# Altium schematic sheet ui_mcup.SchDoc: mcHF QRP Transceiver UI board
size A4; Author: K Atanassov; CompanyName: M0NKA; Revision: 0.6.3; SheetTotal: 5
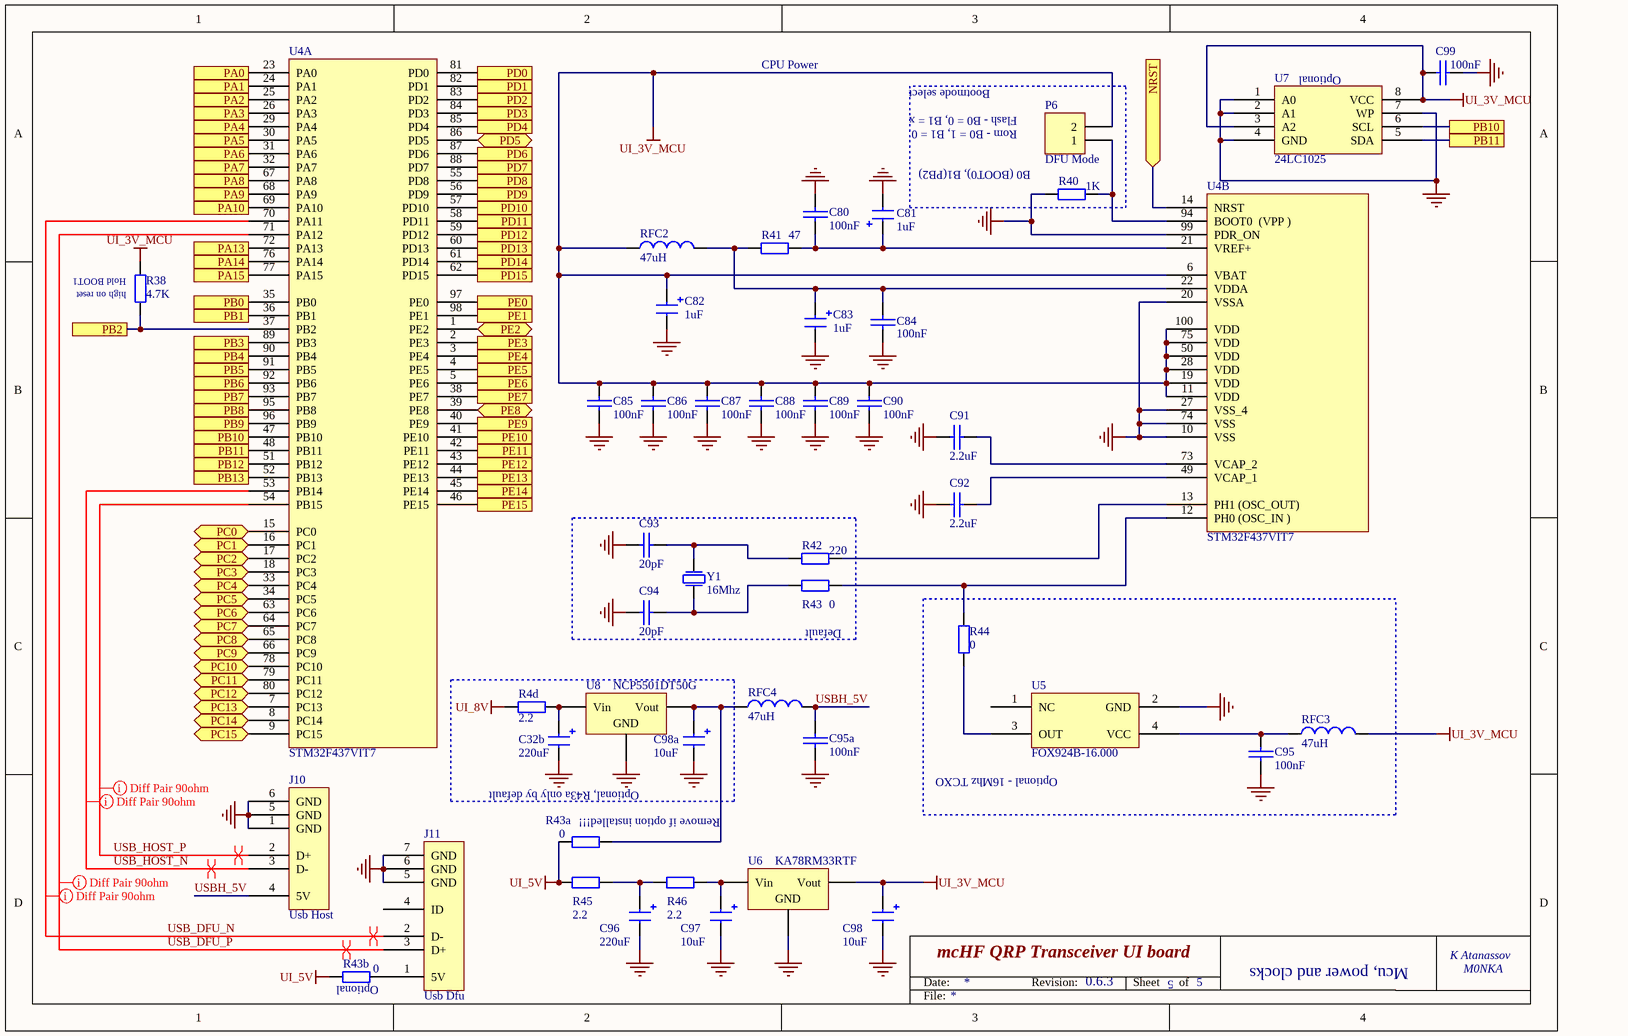
[diagram p0: ui_mcup.SchDoc]

## Parts
C32b  220uF  [CAP_ALUM]  (no BOM)
C80  100nF  [0805-Pro]
C81  1uF  [1206_ELEC_CAP_N]
C82  1uF  [1206_ELEC_CAP_N]
C83  1uF  [1206_ELEC_CAP_N]
C84  100nF  [0805-Pro]
C85  100nF  [0805-Pro]
C86  100nF  [0805-Pro]
C87  100nF  [0805-Pro]
C88  100nF  [0805-Pro]
C89  100nF  [0805-Pro]
C90  100nF  [0805-Pro]
C91  2.2uF  [0805-Pro]
C92  2.2uF  [0805-Pro]
C93  20pF  [0805-Pro]
C94  20pF  [0805-Pro]
C95  100nF  [0805-Pro]  (no BOM)
C95a  100nF  [0805-Pro]
C96  220uF  [CAP_ALUM]
C97  10uF  [1206_ELEC_CAP_N]
C98  10uF  [1206_ELEC_CAP_N]
C98a  10uF  [1206_ELEC_CAP_N]  (no BOM)
C99  100nF  [0805-Pro]
J10  Usb Host  [USB_OUT_A]
J11  Usb Dfu  [MINI_USB_B_SMD]
P6  DFU Mode  [SIP2]
R4d  2.2  [1206]  (no BOM)
R38  4.7K  [0805-Pro]
R40  1K  [0805-Pro]
R41  47  [0805-Pro]
R42  220  [0805-Pro]
R43  0  [0805-Pro]
R43a  0  [0805-Pro]
R43b  0  [0805-Pro]
R44  0  [0805-Pro]  (no BOM)
R45  2.2  [1206]
R46  2.2  [1206]
RFC2  47uH  [0805-Pro]
RFC3  47uH  [0805-Pro]  (no BOM)
RFC4  47uH  [0805-Pro]
U4  STM32F437VIT7  [SQFP14X14-100-Pro]  (parts A,B of 2)
U5  FOX924B-16.000  [2SMX-3SMXB]  (no BOM)
U6  KA78RM33RTF  [TO-252]
U7  24LC1025  [SO-8-Pro]
U8  NCP5501DT50G  [TO-252]  (no BOM)
Y1  16Mhz  [HC49/4H_SMX]

## Blocks framed on the sheet
Default: C93 C94 R42 R43 Y1
Optional - 16Mhz TCXO: C95 R44 RFC3 U5
Optional, R43a only by default: C32b C98a R4d U8

## Ports
NRST (in), PA0, PA1, PA2, PA3, PA4, PA5, PA6, PA7, PA8, PA9, PA10, PA13, PA14, PA15, PB0, PB1, PB2, PB3, PB4, PB5, PB6, PB7, PB8, PB9, PB10, PB11, PB12, PB13, PC0 (bidir), PC1 (bidir), PC2 (bidir), PC3 (bidir), PC4 (bidir), PC5 (bidir), PC6 (bidir), PC7 (bidir), PC8 (bidir), PC9 (bidir), PC10 (bidir), PC11 (bidir), PC12 (bidir), PC13 (bidir), PC14 (bidir), PC15 (bidir), PD0, PD1, PD2, PD3, PD4, PD5 (bidir), PD6, PD7, PD8, PD9, PD10, PD11, PD12, PD13, PD14, PD15, PE0, PE1, PE2 (bidir), PE3, PE4, PE5, PE6, PE7, PE8 (bidir), PE9, PE10, PE11, PE12, PE13, PE14, PE15

## Nets
GND: C32b.2 C80.2 C81.2 C82.2 C83.2 C84.1 C85.1 C86.1 C87.1 C88.1 C89.1 C90.1 C91.1 C92.1 C93.1 C94.1 C95.1 C95a.1 C96.2 C97.2 C98.2 C98a.2 C99.2 J10.1(GND) J10.5(GND) J10.6(GND) J11.5(GND) J11.6(GND) J11.7(GND) R40.1 U4.10(VSS) U4.20(VSSA) U4.27(VSS_4) U4.74(VSS) U4.99(PDR_ON) U5.2(GND) U6.2(GND) U7.1(A0) U7.2(A1) U7.4(GND) U7.7(WP) U8.2(GND)
UI_3V_MCU: C82.1 C85.2 C86.2 C87.2 C88.2 C89.2 C90.2 C98.1 C99.1 P6.2 R38.1 RFC2.1 RFC3.2 U4.6(VBAT) U4.11(VDD) U4.19(VDD) U4.28(VDD) U4.50(VDD) U4.75(VDD) U4.100(VDD) U6.3(Vout) U7.3(A2) U7.8(VCC)
UI_5V: R43a.1 R43b.1 R45.1
UI_8V: R4d.1
NRST: U4.14(NRST) ; port NRST
PA0: U4.23(PA0) ; port PA0
PA1: U4.24(PA1) ; port PA1
PA2: U4.25(PA2) ; port PA2
PA3: U4.26(PA3) ; port PA3
PA4: U4.29(PA4) ; port PA4
PA5: U4.30(PA5) ; port PA5
PA6: U4.31(PA6) ; port PA6
PA7: U4.32(PA7) ; port PA7
PA8: U4.67(PA8) ; port PA8
PA9: U4.68(PA9) ; port PA9
PA10: U4.69(PA10) ; port PA10
PA13: U4.72(PA13) ; port PA13
PA14: U4.76(PA14) ; port PA14
PA15: U4.77(PA15) ; port PA15
PB0: U4.35(PB0) ; port PB0
PB1: U4.36(PB1) ; port PB1
PB2: R38.2 U4.37(PB2) ; port PB2
PB3: U4.89(PB3) ; port PB3
PB4: U4.90(PB4) ; port PB4
PB5: U4.91(PB5) ; port PB5
PB6: U4.92(PB6) ; port PB6
PB7: U4.93(PB7) ; port PB7
PB8: U4.95(PB8) ; port PB8
PB9: U4.96(PB9) ; port PB9
PB10: U4.47(PB10) U7.6(SCL) ; port PB10
PB11: U4.48(PB11) U7.5(SDA) ; port PB11
PB12: U4.51(PB12) ; port PB12
PB13: U4.52(PB13) ; port PB13
PC0: U4.15(PC0) ; port PC0
PC1: U4.16(PC1) ; port PC1
PC2: U4.17(PC2) ; port PC2
PC3: U4.18(PC3) ; port PC3
PC4: U4.33(PC4) ; port PC4
PC5: U4.34(PC5) ; port PC5
PC6: U4.63(PC6) ; port PC6
PC7: U4.64(PC7) ; port PC7
PC8: U4.65(PC8) ; port PC8
PC9: U4.66(PC9) ; port PC9
PC10: U4.78(PC10) ; port PC10
PC11: U4.79(PC11) ; port PC11
PC12: U4.80(PC12) ; port PC12
PC13: U4.7(PC13) ; port PC13
PC14: U4.8(PC14) ; port PC14
PC15: U4.9(PC15) ; port PC15
PD0: U4.81(PD0) ; port PD0
PD1: U4.82(PD1) ; port PD1
PD2: U4.83(PD2) ; port PD2
PD3: U4.84(PD3) ; port PD3
PD4: U4.85(PD4) ; port PD4
PD5: U4.86(PD5) ; port PD5
PD6: U4.87(PD6) ; port PD6
PD7: U4.88(PD7) ; port PD7
PD8: U4.55(PD8) ; port PD8
PD9: U4.56(PD9) ; port PD9
PD10: U4.57(PD10) ; port PD10
PD11: U4.58(PD11) ; port PD11
PD12: U4.59(PD12) ; port PD12
PD13: U4.60(PD13) ; port PD13
PD14: U4.61(PD14) ; port PD14
PD15: U4.62(PD15) ; port PD15
PE0: U4.97(PE0) ; port PE0
PE1: U4.98(PE1) ; port PE1
PE2: U4.1(PE2) ; port PE2
PE3: U4.2(PE3) ; port PE3
PE4: U4.3(PE4) ; port PE4
PE5: U4.4(PE5) ; port PE5
PE6: U4.5(PE6) ; port PE6
PE7: U4.38(PE7) ; port PE7
PE8: U4.39(PE8) ; port PE8
PE9: U4.40(PE9) ; port PE9
PE10: U4.41(PE10) ; port PE10
PE11: U4.42(PE11) ; port PE11
PE12: U4.43(PE12) ; port PE12
PE13: U4.44(PE13) ; port PE13
PE14: U4.45(PE14) ; port PE14
PE15: U4.46(PE15) ; port PE15
USB_DFU_N: J11.2(D-) U4.70(PA11)
USB_DFU_P: J11.3(D+) U4.71(PA12)
USB_HOST_N: J10.3(D-) U4.53(PB14)
USB_HOST_P: J10.2(D+) U4.54(PB15)
USBH_5V: C95a.2 J10.4(5V) RFC4.2
NetC32b_1: C32b.1 R4d.2 U8.1(Vin)
NetC80_1: C80.1 C81.1 R41.2 U4.21(VREF+)
NetC83_1: C83.1 C84.2 R41.1 RFC2.2 U4.22(VDDA)
NetC91_2: C91.2 U4.73(VCAP_2)
NetC92_2: C92.2 U4.49(VCAP_1)
NetC93_2: C93.2 R42.1 Y1.1(P1)
NetC94_2: C94.2 R43.1 Y1.2(P2)
NetC95_2: C95.2 RFC3.1 U5.4(VCC)
NetC96_1: C96.1 R45.2 R46.1
NetC97_1: C97.1 R46.2 U6.1(Vin)
NetC98a_1: C98a.1 R43a.2 RFC4.1 U8.3(Vout)
NetJ11_1: J11.1(5V) R43b.2
NetP6_1: P6.1 R40.2 U4.94(BOOT0__(VPP_))
NetR42_2: R42.2 U4.13(PH1_(OSC_OUT))
NetR43_2: R43.2 R44.2 U4.12(PH0_(OSC_IN_))
NetR44_1: R44.1 U5.3(OUT)

Not connected (* = marked no-connect by the designer): J11 4(ID); U5 1(NC)

## Layout directives
differential pair: USB_DFU_N, USB_DFU_P, USB_HOST_N, USB_HOST_P
rule Matched Net Lengths [Tolerance = 150mil]: USB_DFU_N, USB_DFU_P, USB_HOST_N, USB_HOST_P

## Notes on the sheet
- CPU Power
- Bootmode select
- Flash - B0 = 0, B1 = x
- (near U7) Optional
- Rom - B0 = 1, B1 = 0
- B0 (BOOT0), B1(PB2)
- (near R38) Hold BOOT1
- (near R38) high on reset
- (near R43a) Remove if option installed!!!
- (near R43b) Optional
- 5
- Mcu, power and clocks
- Date:
- Revision:
- Sheet
- of
- File:

## Library data of the parts
C32b C96 = CAP-POL: Electrolitic capacitor; Order: FN 225-4321; QT Order: QCC-00320; Price: 0.34
C80 C84-C90 C95 C95a C99 = CAP: Capacitor; Order: FN 174-0673; QT Order: QCC-00154; Price: 0.068
C81-C83 = CAP-POL: Electrolitic capacitor; Order: FN 145-7406; QT Order: QCC-00165; Price: 0.235
C91 C92 = CAP: Capacitor; Order: FN 184-5751; QT Order: QCC-00103; Price: 0.115
C93 C94 = CAP: Capacitor; Order: FN 233-2762; Checked: NA; Price: 0.094
C97 C98 C98a = CAP-POL: Electrolitic capacitor; Order: FN 233-3009; QT Order: QCC-00166; Price: 0.204
J10 = USB_OUT: USB Host Connector; Order: FN 117-7883; Price: 0.60
J11 = MINI_USB_B: Mini USB connector; Order: FN 211-2367; QT Order: QCJ-00083; Price: 0.62
P6 = Header 2: Header, 2-Pin; Order: NA; Price: 0; Checked: NA
R4d R45 R46 = RES: Resistor; Order: FN 207-8984; QT Order: QCR-00412; Price: 0.02
R38 = RES: Resistor; Order: FN 200-8383; QT Order: QCR-00341; Price: 0.024
R40 = RES: Resistor; Order: FN 157-6459; QT Order: QCR-00326; Price: 0.061
R41 = RES: Resistor; Order: FN 173-8942; QT Order: QCR-00293; Price: 0.052
R42 = RES: Resistor; Order: FN 933-2804; QT Order: QCR-00309; Price: 0.007
R43 R43a R43b R44 = RES: Resistor; Order: FN 933-3681; QT Order: QCR-00268; Price: 0.009
RFC2-RFC4 = Inductor: Order: FN 166-9895; Price: 0.16
U4 = STM32F40x-VG: STM32F4 controller; Order: FN 233-3297; Price: 8.07
U5 = FOX924B-16.000: TCXO; Order: FN 206-3959; Price: 2.77
U6 = UA78M33CKVURG3: VOLT REG, 3.3V, TO-252; Order: FN 245-1041; Price: 0.39
U7 = 24LC01B: 1K I2C Eeprom; Order: FN 133-1323; QT Order: QCI-00053; Price: 2.81
U8 = MC7805BTG: VOLTAGE REG, 40V, TO220-3; Order: FN 170-3369; Price: 0.53
Y1 = XTAL: Crystal Oscillator; Order: FN 971-3808; Checked: NA; Price: 0.51